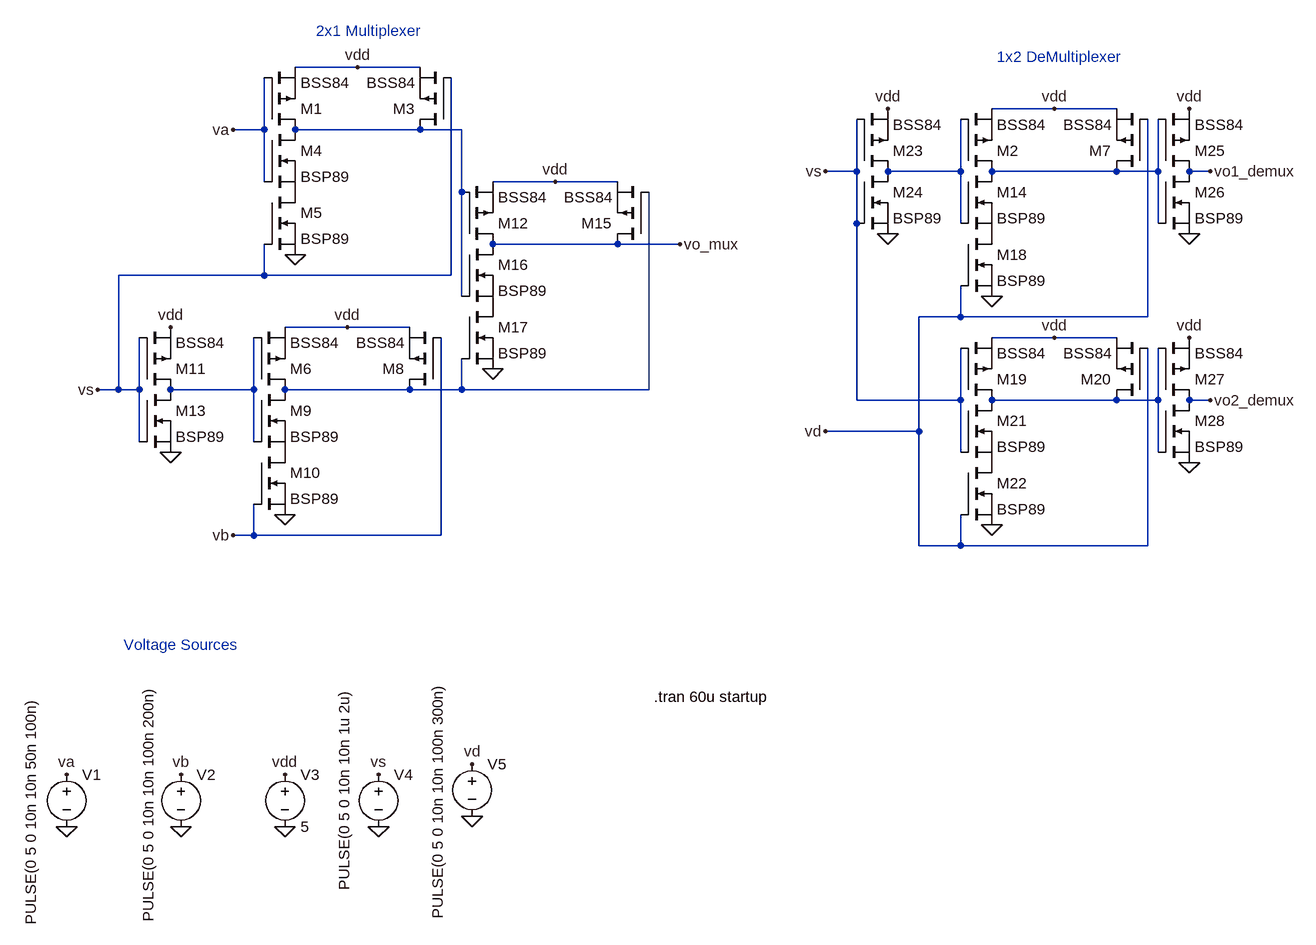
[diagram p0: schematic Mux DeMux.asc]
Mux DeMux.asc, the LTspice schematic file:
Version 4.1
SHEET 1 2328 1352
WIRE 224 0 128 0
WIRE 320 0 224 0
WIRE 1296 64 1200 64
WIRE 1392 64 1296 64
WIRE 80 96 80 16
WIRE 80 96 32 96
WIRE 320 96 128 96
WIRE 384 96 320 96
WIRE 992 160 992 80
WIRE 992 160 944 160
WIRE 1152 160 1152 80
WIRE 1152 160 1040 160
WIRE 1392 160 1200 160
WIRE 1456 160 1456 80
WIRE 1456 160 1392 160
WIRE 1536 160 1504 160
WIRE 80 176 80 96
WIRE 528 176 432 176
WIRE 624 176 528 176
WIRE 384 192 384 96
WIRE 992 240 992 160
WIRE 1152 240 1152 160
WIRE 1456 240 1456 160
WIRE 624 272 432 272
WIRE 720 272 624 272
WIRE 80 320 80 272
WIRE 80 320 -144 320
WIRE 368 320 368 16
WIRE 368 320 80 320
WIRE 384 352 384 192
WIRE 1152 384 1152 336
WIRE 1152 384 1088 384
WIRE 1440 384 1440 80
WIRE 1440 384 1152 384
WIRE 208 400 112 400
WIRE 304 400 208 400
WIRE 1296 416 1200 416
WIRE 1392 416 1296 416
WIRE -144 496 -144 320
WIRE -144 496 -176 496
WIRE -112 496 -112 416
WIRE -112 496 -144 496
WIRE 64 496 64 416
WIRE 64 496 -64 496
WIRE 304 496 112 496
WIRE 384 496 384 448
WIRE 384 496 304 496
WIRE 672 496 672 192
WIRE 672 496 384 496
WIRE 992 512 992 240
WIRE 1152 512 1152 432
WIRE 1152 512 992 512
WIRE 1392 512 1200 512
WIRE 1456 512 1456 432
WIRE 1456 512 1392 512
WIRE 1536 512 1504 512
WIRE 1088 560 1088 384
WIRE 1088 560 944 560
WIRE -112 576 -112 496
WIRE 64 576 64 496
WIRE 1152 592 1152 512
WIRE 1456 592 1456 512
WIRE 64 720 64 672
WIRE 64 720 32 720
WIRE 352 720 352 416
WIRE 352 720 64 720
WIRE 1088 736 1088 560
WIRE 1152 736 1152 688
WIRE 1152 736 1088 736
WIRE 1440 736 1440 432
WIRE 1440 736 1152 736
FLAG 128 288 0
FLAG 112 688 0
FLAG -64 400 vdd
FLAG -64 592 0
FLAG -176 496 vs
FLAG 32 96 va
FLAG 32 720 vb
FLAG 432 464 0
FLAG 720 272 vo_mux
FLAG -224 1168 0
FLAG -48 1168 0
FLAG 112 1168 0
FLAG 256 1168 0
FLAG 112 1088 vdd
FLAG -48 1088 vb
FLAG 256 1088 vs
FLAG -224 1088 va
FLAG 208 400 vdd
FLAG 224 0 vdd
FLAG 528 176 vdd
FLAG 1200 352 0
FLAG 1296 64 vdd
FLAG 1200 704 0
FLAG 1296 416 vdd
FLAG 1040 256 0
FLAG 1040 64 vdd
FLAG 944 160 vs
FLAG 944 560 vd
FLAG 1536 160 vo1_demux
FLAG 1536 512 vo2_demux
FLAG 400 1152 0
FLAG 400 1072 vd
FLAG 1504 256 0
FLAG 1504 64 vdd
FLAG 1504 608 0
FLAG 1504 416 vdd
SYMBOL pmos 80 96 M180
SYMATTR InstName M1
SYMATTR Value BSS84
SYMBOL pmos 368 96 R180
SYMATTR InstName M3
SYMATTR Value BSS84
SYMBOL nmos 80 96 R0
SYMATTR InstName M4
SYMATTR Value BSP89
SYMBOL nmos 80 192 R0
SYMATTR InstName M5
SYMATTR Value BSP89
SYMBOL pmos 64 496 M180
SYMATTR InstName M6
SYMATTR Value BSS84
SYMBOL pmos 352 496 R180
SYMATTR InstName M8
SYMATTR Value BSS84
SYMBOL nmos 64 496 R0
SYMATTR InstName M9
SYMATTR Value BSP89
SYMBOL nmos 64 592 R0
SYMATTR InstName M10
SYMATTR Value BSP89
SYMBOL pmos -112 496 M180
SYMATTR InstName M11
SYMATTR Value BSS84
SYMBOL nmos -112 496 R0
SYMATTR InstName M13
SYMATTR Value BSP89
SYMBOL pmos 384 272 M180
SYMATTR InstName M12
SYMATTR Value BSS84
SYMBOL pmos 672 272 R180
SYMATTR InstName M15
SYMATTR Value BSS84
SYMBOL nmos 384 272 R0
SYMATTR InstName M16
SYMATTR Value BSP89
SYMBOL nmos 384 368 R0
SYMATTR InstName M17
SYMATTR Value BSP89
SYMBOL voltage -224 1072 R0
WINDOW 3 -55 -104 VRight 2
WINDOW 123 0 0 Left 0
WINDOW 39 0 0 Left 0
SYMATTR Value PULSE(0 5 0 10n 10n 50n 100n)
SYMATTR InstName V1
SYMBOL voltage -48 1072 R0
WINDOW 3 -50 -121 VRight 2
WINDOW 123 0 0 Left 0
WINDOW 39 0 0 Left 0
SYMATTR Value PULSE(0 5 0 10n 10n 100n 200n)
SYMATTR InstName V2
SYMBOL voltage 112 1072 R0
WINDOW 123 0 0 Left 0
WINDOW 39 0 0 Left 0
SYMATTR InstName V3
SYMATTR Value 5
SYMBOL voltage 256 1072 R0
WINDOW 3 -53 -116 VRight 2
WINDOW 123 0 0 Left 0
WINDOW 39 0 0 Left 0
SYMATTR Value PULSE(0 5 0 10n 10n 1u 2u)
SYMATTR InstName V4
SYMBOL pmos 1152 160 M180
SYMATTR InstName M2
SYMATTR Value BSS84
SYMBOL pmos 1440 160 R180
SYMATTR InstName M7
SYMATTR Value BSS84
SYMBOL nmos 1152 160 R0
SYMATTR InstName M14
SYMATTR Value BSP89
SYMBOL nmos 1152 256 R0
SYMATTR InstName M18
SYMATTR Value BSP89
SYMBOL pmos 1152 512 M180
SYMATTR InstName M19
SYMATTR Value BSS84
SYMBOL pmos 1440 512 R180
SYMATTR InstName M20
SYMATTR Value BSS84
SYMBOL nmos 1152 512 R0
SYMATTR InstName M21
SYMATTR Value BSP89
SYMBOL nmos 1152 608 R0
SYMATTR InstName M22
SYMATTR Value BSP89
SYMBOL pmos 992 160 M180
SYMATTR InstName M23
SYMATTR Value BSS84
SYMBOL nmos 992 160 R0
SYMATTR InstName M24
SYMATTR Value BSP89
SYMBOL voltage 400 1056 R0
WINDOW 3 -53 -110 VRight 2
WINDOW 123 0 0 Left 0
WINDOW 39 0 0 Left 0
SYMATTR InstName V5
SYMATTR Value PULSE(0 5 0 10n 10n 100n 300n)
SYMBOL pmos 1456 160 M180
SYMATTR InstName M25
SYMATTR Value BSS84
SYMBOL nmos 1456 160 R0
SYMATTR InstName M26
SYMATTR Value BSP89
SYMBOL pmos 1456 512 M180
SYMATTR InstName M27
SYMATTR Value BSS84
SYMBOL nmos 1456 512 R0
SYMATTR InstName M28
SYMATTR Value BSP89
TEXT 680 968 Left 2 !.tran 60u startup
TEXT 160 -56 Left 2 ;2x1 Multiplexer
TEXT -136 888 Left 2 ;Voltage Sources
TEXT 1208 -16 Left 2 ;1x2 DeMultiplexer

The netlist it stands for:
* Mux DeMux.asc
M1 N001 va vdd vdd BSS84
M3 N001 vs vdd vdd BSS84
M4 N001 va P001 P001 BSP89
M5 P001 vs 0 0 BSP89
M6 N005 N004 vdd vdd BSS84
M8 N005 vb vdd vdd BSS84
M9 N005 N004 P002 P002 BSP89
M10 P002 vb 0 0 BSP89
M11 N004 vs vdd vdd BSS84
M13 N004 vs 0 0 BSP89
M12 vo_mux N001 vdd vdd BSS84
M15 vo_mux N005 vdd vdd BSS84
M16 vo_mux N001 P003 P003 BSP89
M17 P003 N005 0 0 BSP89
V1 va 0 PULSE(0 5 0 10n 10n 50n 100n)
V2 vb 0 PULSE(0 5 0 10n 10n 100n 200n)
V3 vdd 0 5
V4 vs 0 PULSE(0 5 0 10n 10n 1u 2u)
M2 N003 N002 vdd vdd BSS84
M7 N003 vd vdd vdd BSS84
M14 N003 N002 P004 P004 BSP89
M18 P004 vd 0 0 BSP89
M19 N006 vs vdd vdd BSS84
M20 N006 vd vdd vdd BSS84
M21 N006 vs P005 P005 BSP89
M22 P005 vd 0 0 BSP89
M23 N002 vs vdd vdd BSS84
M24 N002 vs 0 0 BSP89
V5 vd 0 PULSE(0 5 0 10n 10n 100n 300n)
M25 vo1_demux N003 vdd vdd BSS84
M26 vo1_demux N003 0 0 BSP89
M27 vo2_demux N006 vdd vdd BSS84
M28 vo2_demux N006 0 0 BSP89
.model NMOS NMOS
.model PMOS PMOS
.lib standard.mos
.tran 60u startup
* 2x1 Multiplexer
* Voltage Sources
* 1x2 DeMultiplexer
.backanno
.end